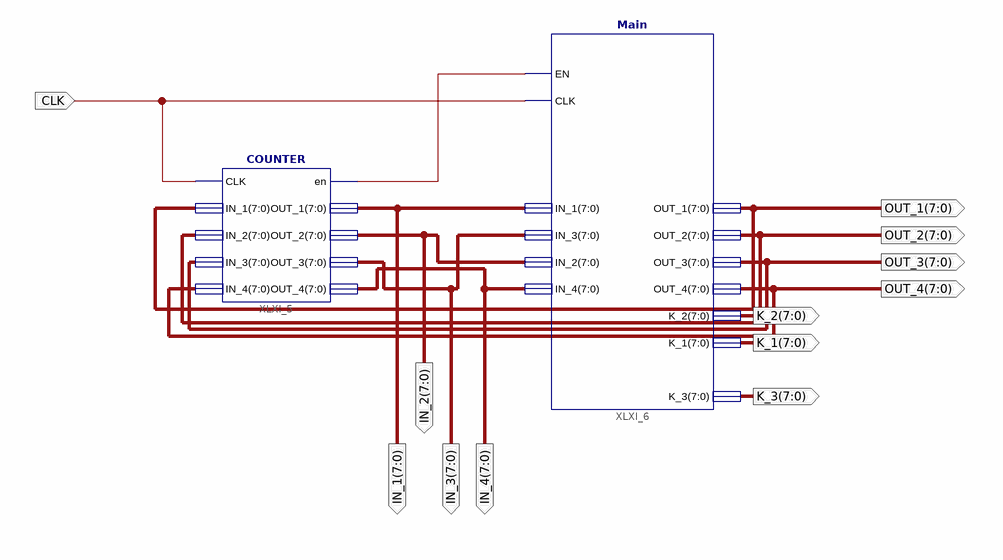
[diagram p0: schematic sheet 1]
// Xilinx ISE schematic Rough.sch (spartan3e) as structural Verilog: 2 symbols, 12 ports
module Rough (
  input  CLK,
  output [7:0] OUT_4,
  output [7:0] OUT_3,
  output [7:0] OUT_2,
  output [7:0] OUT_1,
  output [7:0] IN_1,
  output [7:0] IN_2,
  output [7:0] IN_3,
  output [7:0] IN_4,
  output [7:0] K_2,
  output [7:0] K_1,
  output [7:0] K_3
);

  wire XLXN_17;

  COUNTER XLXI_5 (
    .CLK(CLK), .IN_1(OUT_1), .IN_2(OUT_2), .IN_3(OUT_3), .IN_4(OUT_4), .en(XLXN_17), .OUT_1(IN_1),
    .OUT_2(IN_2), .OUT_3(IN_3), .OUT_4(IN_4));
  Main XLXI_6 (
    .IN_1(IN_1), .EN(XLXN_17), .CLK(CLK), .IN_3(IN_3), .IN_2(IN_2), .IN_4(IN_4), .OUT_1(OUT_1),
    .OUT_2(OUT_2), .OUT_3(OUT_3), .OUT_4(OUT_4), .K_3(K_3), .K_2(K_2), .K_1(K_1));
endmodule
